# Altium schematic sheet CDS_JETSON_ADAPTER_SCH_v1.0.2.SchDoc
size A3; Author: HaBV3; CompanyName: FPT CORPORATION; Address1: FPT Building,17-Duy Tan,; Address2: Cau Giay, Ha Noi, Viet Nam; Revision: v1.0; SheetNumber: 1; SheetTotal: 3; Project: FPT; DocumentName: Schematic.SchDoc
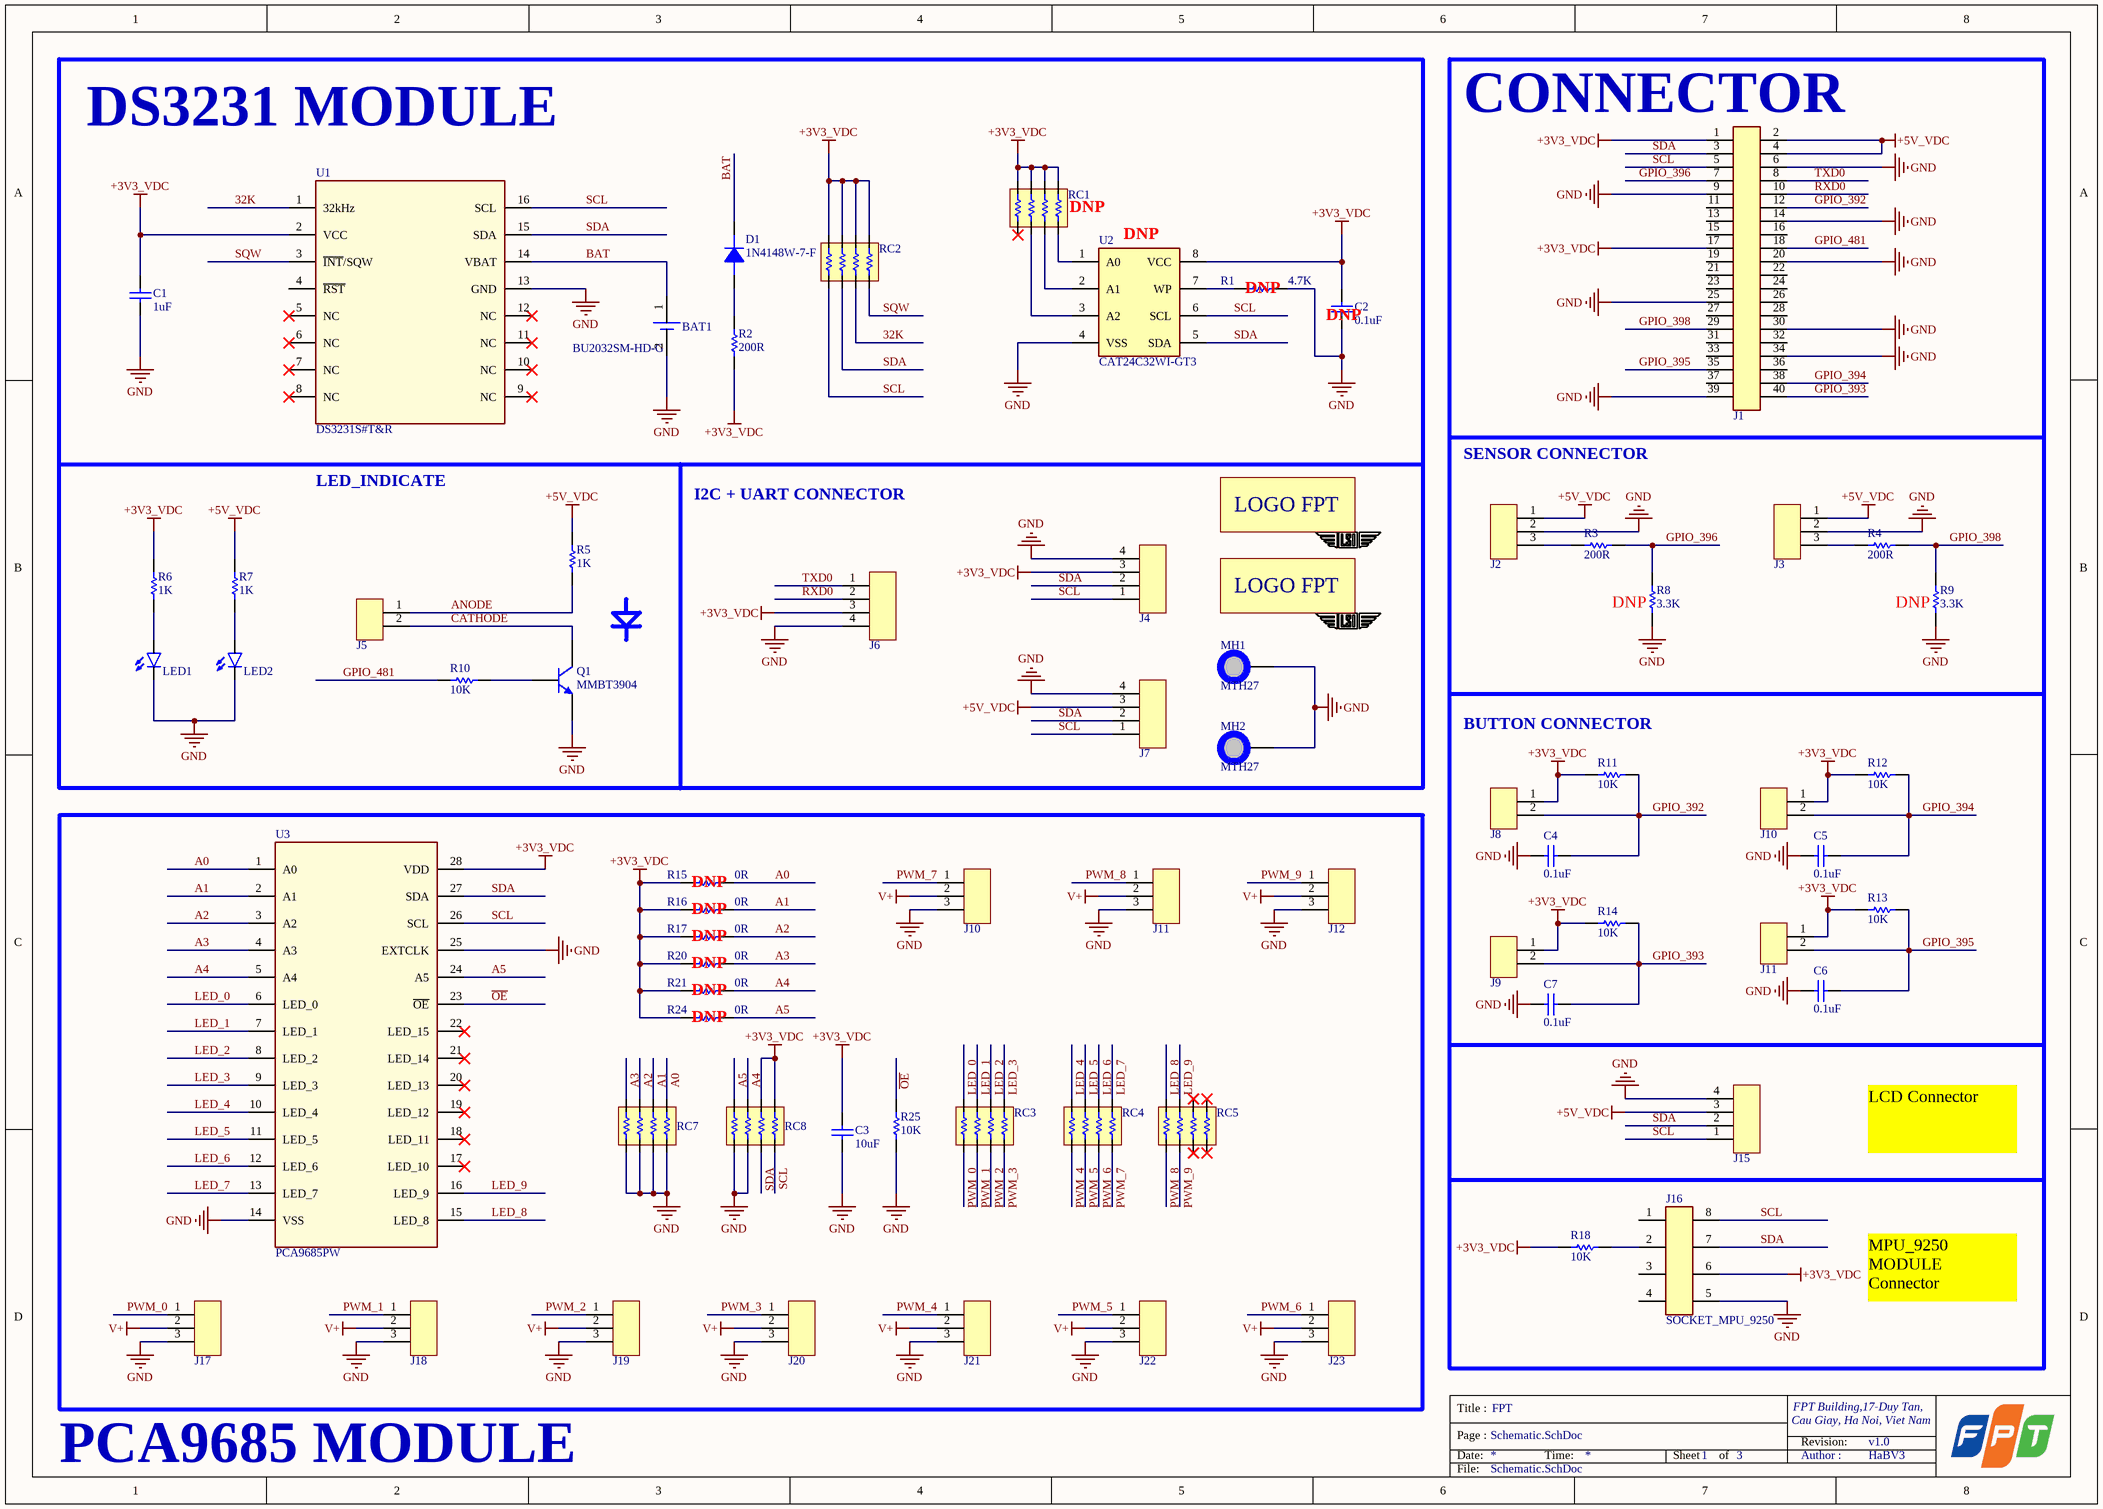
[diagram p0: CDS_JETSON_ADAPTER_SCH_v1.0.2.SchDoc]

## Parts
(Parts that share a designator on the sheet are numbered #1, #2 ... from top to bottom, then left to right.)
BAT1  BU2032SM-HD-G  [BU2032SM-HD-G]
C1  value 1uF  [C0603]  (hidden comment: GRM188R61A106ME69D)
C2  value 0.1uF  [C0603]  (hidden comment: GRM188R70J104KA01D)
C3  value 10uF  [C0603]  (hidden comment: GRM188R61C106KAALD)
C4  value 0.1uF  [C0603]  (hidden comment: GCM188R71H104KA57J)
C5  value 0.1uF  [C0603]  (hidden comment: GCM188R71H104KA57J)
C6  value 0.1uF  [C0603]  (hidden comment: GCM188R71H104KA57J)
C7  value 0.1uF  [C0603]  (hidden comment: GCM188R71H104KA57J)
D1  1N4148W-7-F  [DO-SOD-123]
J1  HDR_2x20  [HEADER_SOCKET_2.54MM_2x20]  (value not drawn)
J2  HDR_1x3  [B3B-XH-A(LF)(SN)]  (value not drawn)
J3  HDR_1x3  [B3B-XH-A(LF)(SN)]  (value not drawn)
J4  HDR_1x4  [B4B-XH-A(LF)(SN)]  (value not drawn)
J5  HDR_1x2  [B2B-XH-A(LF)(SN)]  (value not drawn)
J6  HDR_1x4  [B4B-XH-A(LF)(SN)]  (value not drawn)
J7  HDR_1x4  [B4B-XH-A(LF)(SN)]  (value not drawn)
J8  HDR_1x2  [B2B-XH-A(LF)(SN)]  (value not drawn)
J9  HDR_1x2  [B2B-XH-A(LF)(SN)]  (value not drawn)
J10#1  HDR_1x2  [B2B-XH-A(LF)(SN)]  (value not drawn)
J10#2  HDR_1x3  [PINHEAD_2.54mm_1x3]  (value not drawn)
J11#1  HDR_1x3  [PINHEAD_2.54mm_1x3]  (value not drawn)
J11#2  HDR_1x2  [B2B-XH-A(LF)(SN)]  (value not drawn)
J12  HDR_1x3  [PINHEAD_2.54mm_1x3]  (value not drawn)
J15  HDR_1x4  [B4B-XH-A(LF)(SN)]  (value not drawn)
J16  SOCKET_MPU_9250  [SOCKET_MPU_9250]
J17  HDR_1x3  [PINHEAD_2.54mm_1x3]  (value not drawn)
J18  HDR_1x3  [PINHEAD_2.54mm_1x3]  (value not drawn)
J19  HDR_1x3  [PINHEAD_2.54mm_1x3]  (value not drawn)
J20  HDR_1x3  [PINHEAD_2.54mm_1x3]  (value not drawn)
J21  HDR_1x3  [PINHEAD_2.54mm_1x3]  (value not drawn)
J22  HDR_1x3  [PINHEAD_2.54mm_1x3]  (value not drawn)
J23  HDR_1x3  [PINHEAD_2.54mm_1x3]  (value not drawn)
LED1  LTST-C191KRKT  [LED-SMD-0603-RED]  (value not drawn)
LED2  LTST-C191KRKT  [LED-SMD-0603-RED]  (value not drawn)
LOGO1  LOGOFPT  [LOGO_FPT]  (value not drawn)
LOGO2  LOGOFPT  [LOGO_FPT]  (value not drawn)
MH1  MTH27  [MH_5.2MMD_2.7MMD]
MH2  MTH27  [MH_5.2MMD_2.7MMD]
Q1  MMBT3904  [MMBT3904]
R1  value 4.7K  [R0603]  (hidden comment: RC0603JR-074K7L)
R2  value 200R  [R0603]  (hidden comment: RC0603JR-07200RL)
R3  value 200R  [R0603]  (hidden comment: RC0603JR-07200RL)
R4  value 200R  [R0603]  (hidden comment: RC0603JR-07200RL)
R5  value 1K  [R0603]  (hidden comment: RC0603FR-071KL)
R6  value 1K  [R0603]  (hidden comment: RC0603FR-071KL)
R7  value 1K  [R0603]  (hidden comment: RC0603FR-071KL)
R8  value 3.3K  [R0603]  (hidden comment: RC0603FR-073K3L)
R9  value 3.3K  [R0603]  (hidden comment: RC0603FR-073K3L)
R10  value 10K  [R0603]  (hidden comment: RC0603JR-0710KL)
R11  value 10K  [R0603]  (hidden comment: RC0603JR-0710KL)
R12  value 10K  [R0603]  (hidden comment: RC0603JR-0710KL)
R13  value 10K  [R0603]  (hidden comment: RC0603JR-0710KL)
R14  value 10K  [R0603]  (hidden comment: RC0603JR-0710KL)
R15  value 0R  [R0603]  (hidden comment: RC0603JR-070RL)
R16  value 0R  [R0603]  (hidden comment: RC0603JR-070RL)
R17  value 0R  [R0603]  (hidden comment: RC0603JR-070RL)
R18  value 10K  [R0603]  (hidden comment: RC0603JR-0710KL)
R20  value 0R  [R0603]  (hidden comment: RC0603JR-070RL)
R21  value 0R  [R0603]  (hidden comment: RC0603JR-070RL)
R24  value 0R  [R0603]  (hidden comment: RC0603JR-070RL)
R25  value 10K  [R0603]  (hidden comment: RC0603JR-0710KL)
RC1  YC164-JR-074K7L  [RC_1206]  (value not drawn)
RC2  YC164-JR-074K7L  [RC_1206]  (value not drawn)
RC3  YC164-JR-07220RL  [RC_1206]  (value not drawn)
RC4  YC164-JR-07220RL  [RC_1206]  (value not drawn)
RC5  YC164-JR-07220RL  [RC_1206]  (value not drawn)
RC7  YC164-JR-0710KL  [RC_1206]  (value not drawn)
RC8  YC164-JR-0710KL  [RC_1206]  (value not drawn)
U1  DS3231S#T&R  [SOIC127P1030X265-16N]
U2  CAT24C32WI-GT3  [SOIC127P600X175-8N]
U3  PCA9685PW  [TSOP65P640X110-28N]

## Blocks framed on the sheet
DS3231 MODULE: BAT1 C1 C2 D1 J4-J7 LED1 LED2 LOGO1 LOGO2 MH1 MH2 Q1 R1 R2 R5-R7 R10 RC1 RC2 U1 U2
CONNECTOR: C4-C7 J1-J3 J8 J9 J10#1 J11#2 J15 J16 R3 R4 R8 R9 R11-R14 R18

## Nets
+3V3_VDC: C1.1 C2.2 C3.1 J1.1 J1.17 J4.3 J6.3 J8.1 J9.1 J10#1.1 J11#2.1 J16.6 R2.1 R6.1 R11.2 R12.2 R13.2 R14.2 R15.1 R16.1 R17.1 R18.1 R20.1 R21.1 R24.1 RC1.5 RC1.6 RC1.7 RC1.8 RC2.5 RC2.6 RC2.7 RC2.8 RC8.5 RC8.6 U1.2(VCC) U2.8(VCC) U3.28(VDD)
+5V_VDC: J1.2 J1.4 J2.1 J3.1 J7.3 J15.3 R5.1 R7.1
GND: BAT1.2(-) C1.2 C2.1 C3.2 C4.1 C5.1 C6.1 C7.1 J1.6 J1.9 J1.14 J1.20 J1.25 J1.30 J1.34 J1.39 J2.2 J3.2 J4.4 J6.4 J7.4 J10#2.3 J11#1.3 J12.3 J15.4 J16.5 J17.3 J18.3 J19.3 J20.3 J21.3 J22.3 J23.3 LED1.C LED2.C MH1.1 MH2.1 Q1.2(E) R1.2 R8.2 R9.2 R25.2 RC7.1 RC7.2 RC7.3 RC7.4 RC8.1 RC8.2 U1.13(GND) U2.4(VSS) U3.14(VSS) U3.25(EXTCLK)
V+: J10#2.2 J11#1.2 J12.2 J17.2 J18.2 J19.2 J20.2 J21.2 J22.2 J23.2
32K: RC2.3 U1.1(32kHz)
~{OE}: R25.1 U3.23(~{OE})
A0: R15.2 RC7.5 U3.1(A0)
A1: R16.2 RC7.6 U3.2(A1)
A2: R17.2 RC7.7 U3.3(A2)
A3: R20.2 RC7.8 U3.4(A3)
A4: R21.2 RC8.7 U3.5(A4)
A5: R24.2 RC8.8 U3.24(A5)
ANODE: J5.1 R5.2
BAT: BAT1.1(+) D1.1(CATHODE) U1.14(VBAT)
CATHODE: J5.2 Q1.3(C)
GPIO_392: C4.2 J1.12 J8.2 R11.1
GPIO_393: C7.2 J1.40 J9.2 R14.1
GPIO_394: C5.2 J1.38 J10#1.2 R12.1
GPIO_395: C6.2 J1.35 J11#2.2 R13.1
GPIO_396: J1.7 R3.1 R8.1
GPIO_398: J1.29 R4.1 R9.1
GPIO_481: J1.18 R10.1
LED_0: RC3.8 U3.6(LED_0)
LED_1: RC3.7 U3.7(LED_1)
LED_2: RC3.6 U3.8(LED_2)
LED_3: RC3.5 U3.9(LED_3)
LED_4: RC4.8 U3.10(LED_4)
LED_5: RC4.7 U3.11(LED_5)
LED_6: RC4.6 U3.12(LED_6)
LED_7: RC4.5 U3.13(LED_7)
LED_8: RC5.8 U3.15(LED_8)
LED_9: RC5.7 U3.16(LED_9)
PWM_0: J17.1 RC3.1
PWM_1: J18.1 RC3.2
PWM_2: J19.1 RC3.3
PWM_3: J20.1 RC3.4
PWM_4: J21.1 RC4.1
PWM_5: J22.1 RC4.2
PWM_6: J23.1 RC4.3
PWM_7: J10#2.1 RC4.4
PWM_8: J11#1.1 RC5.1
PWM_9: J12.1 RC5.2
RXD0: J1.10 J6.2
SCL: J1.5 J4.1 J7.1 J15.1 J16.8 RC2.1 RC8.4 U1.16(SCL) U2.6(SCL) U3.26(SCL)
SDA: J1.3 J4.2 J7.2 J15.2 J16.7 RC2.2 RC8.3 U1.15(SDA) U2.5(SDA) U3.27(SDA)
SQW: RC2.4 U1.3(~{INT}/SQW)
TXD0: J1.8 J6.1
NetD1_2: D1.2(ANODE) R2.2
NetJ2_3: J2.3 R3.2
NetJ3_3: J3.3 R4.2
NetJ16_2: J16.2 R18.2
NetLED1_A: LED1.A R6.2
NetLED2_A: LED2.A R7.2
NetQ1_1: Q1.1(B) R10.2
NetR1_1: R1.1 U2.7(WP)
NetRC1_2: RC1.2 U2.3(A2)
NetRC1_3: RC1.3 U2.2(A1)
NetRC1_4: RC1.4 U2.1(A0)

Not connected (* = marked no-connect by the designer): J1 11 13 15 16 19 21 22 23 24 26 27 28 31 32 33 36 37; J16 1 3 4; RC1 1*; RC5 3* 4* 5* 6*; U1 4(~{RST}) 5(NC)* 6(NC)* 7(NC)* 8(NC)* 9(NC)* 10(NC)* 11(NC)* 12(NC)*; U3 17(LED_10)* 18(LED_11)* 19(LED_12)* 20(LED_13)* 21(LED_14)* 22(LED_15)*

## Notes on the sheet
- (near RC1) DNP
- (near U2) DNP
- (near R1) DNP
- (near C2) DNP
- LED_INDICATE
- I2C + UART CONNECTOR
- SENSOR CONNECTOR
- (near R8) DNP
- (near R9) DNP
- (near R11) BUTTON CONNECTOR
- (near R15) DNP
- (near R16) DNP
- (near R17) DNP
- (near R20) DNP
- (near R21) DNP
- (near R24) DNP
- LCD Connector
- MPU_9250 MODULE Connector
- PCA9685 MODULE
- Title :
- Page :
- Date:
- Time:
- Sheet
- of
- Author :
- Revision:
- File:
- (in symbol LOGO-FPT) LOGO FPT

## Library data of the parts
BAT1 = BU2032SM-HD-G: =Description; Part Name: Battery Holder; Manufacturer Part Description: HOLDER COIN CELL 2032 SMD; Manufacturer Name: MPD; Battery Type: Coin Cell, Holder; Style: Holder; Battery Cell Size: Coin, 20mm; Battery Series: 2032; Part Number: BU2032SM-HD-G; Series: -; Mounting Type: PCB, Surface Mount; Termination Style: SMD (SMT) Tab; Height: 5.28mm; Operating Temperature: -40°C ~ 280°C; Manufacturer Part Number: BU2032SM-HD-G; Supplier Name: Digi-Key
C1 = GRM188R61A106ME69D: CAP CER 10UF 10V X5R 0603; Part Name: CAP-CERAMIC-0603; Manufacturer Name: Murata; Tolerance: ±20%; Part Number: GRM188R61A106ME69D; Manufacturer Part Number: GRM188R61A106ME69D; Supplier Name: Digi-Key; Rated Voltage: 10V; Package: 0603 (1608 Metric); Operating Temperature: -55°C ~ 85°C
C2 = GRM188R70J104KA01D: CAP CER 0.1UF 6.3V X7R 0603; Part Name: CAP-CERAMIC-0603; Manufacturer Name: Murata; Tolerance: 10%; Part Number: GRM188R70J104KA01D; Manufacturer Part Number: GRM188R70J104KA01D; Supplier Name: Digi-Key; Rated Voltage: 6.3V; Package: 0603 (1608 Metric); Operating Temperature: -55°C ~ 125°C
C3 = GRM188R61C106KAALD: CAP CER 10UF 16V X5R 0603; Part Name: CAP-CERAMIC-0603; Manufacturer Name: Murata; Tolerance: ±10%; Part Number: GRM188R61C106KAALD; Manufacturer Part Number: GRM188R61C106KAALD; Supplier Name: Digi-Key; Rated Voltage: 16V; Package: 0603 (1608 Metric); Operating Temperature: -55°C ~ 125°C
C4-C7 = GCM188R71H104KA57J: CAP CER 0.1UF 50V X7R 0603; Part Name: CAP-CERAMIC-0603; Manufacturer Name: Murata; Tolerance: ±10%; Part Number: GCM188R71H104KA57J; Supplier Name: Digi-Key; Rated Voltage: 50V; Package: 0603; Operating Temperature: -55°C ~ 125°C
D1 = 1N4148W-7-F: DIODE GEN PURP 100V 300MA SOD123; Manufacturer Name: Diodes Incorporated; Type: Standard; Current Average Rectified (Io): 300mA (DC); Voltage Forward (Vf) (Max): 1.25V @ 150mA; Reverse Recovery Time (trr): 4ns; Current Reverse Leakage @ Vr: 1µA @ 75V; Capacitance: 2pF @ 0V, 1MHz; Part Number: 1N4148W-7-F; Part Name: 1N4148W-7-F; Manufacturer Part Number: 1N4148W-7-F; Supplier Name: Digi-Key; Voltage DC Reverse (Vr) (Max): 100V; Speed: =< 200mA (Io); Operating Temperature: -55°C ~ 150°C (TJ)
J1 = SSW-120-03-G-D: CONN RCPT .100" 40POS DUAL GOLD; Manufacturer Name: Samtec Inc.; Connector Type: Receptacle; Number of Positions/Contacts: 40; Part Number: SSW-120-03-G-D; Part Name: HEADER_SOCKET_2.54MM_2x20; Series: SSW; Contact Type: Forked; Supplier Part Number: Digi-Key
J2 J3 = B3B-XH-A(LF)(SN): Connector Type: Header; Part Number: B3B-XH-A(LF)(SN); Part Name: B3B-XH-A(LF)(SN); Series: XH; Contact Type: Male Pin
J4 J6 J7 J15 = B4B-XH-A(LF)(SN): CONN HEADER XH TOP 4POS 2.5MM; Manufacturer Name: JST Sales America Inc.; Number of Positions/Contacts: 4; Part Number: B4B-XH-A(LF)(SN); Series: XH; Contact Type: Male Pin; Connector Type: Header; Supplier Part Number: Digi-Key
J5 J8 J9 J10#1 J11#2 = B2B-XH-A(LF)(SN): CONN HEADER XH TOP 2POS 2.5MM; Manufacturer Name: JST Sales America Inc; Connector Type: Header, Shrouded; Number of Positions/Contacts: 2; Part Number: B2B-XH-A(LF)(SN); Series: XH; Contact Type: Male Pin; Supplier Part Number: Digi-Key
J10#2 J11#1 J12 J17-J23 = 61300311121: CONN HEADER 3 POS 2.54; Manufacturer Name: Wurth Electronics Inc.; Number of Positions/Contacts: 3; Part Number: 61300311121; Part Name: HDR_1x3; Series: WR-PHD; Contact Type: Male Pin; Connector Type: Header; Supplier Part Number: Digi-Key
J16 = MPU_9250: Part Number: MPU_9250; Part Name: MPU_9250
LED1 LED2 = LTST-C191KRKT: LED RED CLEAR 0603 SMD; Part Name: LED-SMD-1608-55; Manufacturer Name: Lite-One Inc.; Lens Color: Colorless; Millicandela Rating: 54mcd; Lens Style/Size: Rectangle with Flat Top, 1.10mm x 0.80mm; Voltage - Forward (Vf) (Typ): 2V; Current - Test: 20mA; Viewing Angle: 130°; Wavelength - Dominant: 631nm; Wavelength - Peak: 639nm; Part Number: LTST-C191KRKT; Package: 0603 (1608 Metric); Height Max: 0.55mm; Led Color: Red; Lens Transparency: Clear; Mounting Type: Surface Mount; Manufacturer Part Number: LTST-C191KRKT; Supplier Name: Digi-Key
LOGO1 LOGO2 = LOGO-FPT: =Description; Part Name: LOGO; Manufacturer Part Description: FPT Logo; Part Number: LOGO-FPT
MH1 MH2 = MTH27: =Description; Manufacturer Part Description: Mouting Hole 2.7mm; Part Number: MTH27; Part Name: MTH27
Q1 = MMBT3904: TRANS NPN 40V 0.2A SOT23; Part Name: TRANS-NPN; Manufacturer Name: Fairchild/ON Semiconductor; Frequency - Transition: 350mW; Published: 17-Sep-2003; LatestRevisionDate: 12-Dec-2006; LatestRevisionNote: IPC-7351 Footprint Added.; DatasheetVersion: 13-May-2002; PackageVersion: May-1999; PackageReference: SOT23; Publisher: Altium Limited; PackageDescription: 3-Pin SOT-23 Package 0.95 mm Pitch, 2.3 mm Lead Span; ComponentLink1Description: Manufacturer Link; ComponentLink1URL: http://www.semiconductors.philips.com/; ComponentLink2Description: Datasheet; ComponentLink2URL: http://www.semiconductors.philips.com/acrobat/datasheets/MMBT3904_4.pdf; Supplier 1: Digi-Key; Supplier Part Number 1: MMBT3904FSDKR-ND; Part Number: MMBT3904; Type: NPN; Voltage - Collector Emitter Breakdown (Max): 40V; Operating Temperature: -55°C ~ 150°C (TJ); Package: SOT-23-3; Supplier Name: Digi-Key
R1 = RC0603JR-074K7L: RES SMD 4.7K OHM 5% 1/10W 0603; Manufacturer Name: Yageo; Rated Power: 0.1W; Part Number: RC0603JR-074K7L; Part Name: RES-0603; Manufacturer Part Number: RC0603JR-074K7L; Supplier Name: Digi-Key; Tolerance: ±5%; Package: 0603; Operating Temperature: -55°C ~ 155°C
R2-R4 = RC0603JR-07200RL: RES SMD 200 OHM 5% 1/10W 0603; Manufacturer Name: Yageo; Rated Power: 0.1W; Part Number: RC0603JR-07200RL; Part Name: RES-0603; Manufacturer Part Number: RC0603JR-07200RL; Supplier Name: Digi-Key; Tolerance: ±5%; Package: 0603; Operating Temperature: -55°C ~ 155°C
R5-R7 = RC0603FR-071KL: RES SMD 1K OHM 1% 1/10W 0603; Manufacturer Name: Yageo; Rated Power: 0.15W; Part Number: RC0603FR-071KL; Part Name: RES-0603; Manufacturer Part Number: RC0603FR-071KL; Supplier Name: Digi-Key; Tolerance: 1%; Package: 0603; Operating Temperature: -55°C ~ 155°C
R8 R9 = RC0603FR-073K3L: RES SMD 3.3K OHM 1% 1/10W 0603; Manufacturer Name: Yageo; Rated Power: 0.1W; Part Number: RC0603FR-073K3L; Part Name: RES-0603; Manufacturer Part Number: RC0603FR-073K3L; Supplier Name: Digi-Key; Tolerance: ±1%; Package: 0603; Operating Temperature: -55°C ~ 155°C
R10-R14 R18 R25 = RC0603JR-0710KL: RES SMD 10K OHM 5% 1/10W 0603; Manufacturer Name: Yageo; Rated Power: 0.1W; Part Number: RC0603JR-0710KL; Part Name: RES-0603; Manufacturer Part Number: RC0603JR-0710KL; Supplier Name: Digi-Key; Tolerance: ±5%; Package: 0603; Operating Temperature: -55°C ~ 155°C
R15-R17 R20 R21 R24 = RC0603JR-070RL: RES SMD 0.0OHM JUMPER 1/10W 0603; Manufacturer Name: Yageo; Tolerance: 1%; Rated Power: 0.15W; Part Number: RC0603JR-070RL; Part Name: RES-0603; Manufacturer Part Number: RC0603JR-070RL; Supplier Name: Digi-Key; Package: 0603; Operating Temperature: -55°C ~ 155°C
RC1 RC2 = YC164-JR-074K7L: RES ARRAY 4 RES 4.7K OHM 1206; Manufacturer Name: Yageo; Tolerance: ±5%; Rated Power: 0.1W; Part Number: YC164-JR-074K7L; Part Name: RC; Manufacturer Part Number: YC164-JR-074K7L; Supplier Name: Digi-Key; Value: 4.7K; Package: 1206; Operating Temperature: -55°C ~ 155°C
RC3-RC5 = YC164-JR-07220RL: RES ARRAY 4 RES 220 OHM 1206; Manufacturer Name: Yageo; Value: 220R; Tolerance: ±5%; Rated Power: 0.1W; Part Number: YC164-JR-07220RL; Part Name: RC; Manufacturer Part Number: YC164-JR-07220RL; Supplier Name: Digi-Key; Package: 1206; Operating Temperature: -55°C ~ 155°C
RC7 RC8 = YC164-JR-0710KL: RES ARRAY 4 RES 10K OHM 1206; Manufacturer Name: Yageo; Tolerance: ±5%; Rated Power: 0.1W; Part Number: YC164-JR-0710KL; Part Name: RC; Manufacturer Part Number: YC164-JR-0710KL; Supplier Name: Digi-Key; Value: 10K; Package: 1206; Operating Temperature: -55°C ~ 155°C
U1 = DS3231S#T&R: IC RTC CLK/CALENDAR I2C 16-SOIC; Manufacturer Name: Maxim; Time Format: HH:MM:SS (12/24 hr); Date Format: YY-MM-DD-dd; Interface: I²C, 2-Wire Serial; Voltage - Supply: 2.3 V ~ 5.5 V; Current - Timekeeping (Max): 110µA ~ 170µA @ 3.63V ~ 5.5V; Part Number: DS3231S#T&R; Part Name: DS3231S#T&R; Serial: -; Type: Clock/Calendar; Voltage - Supply, Battery: 2.3 V ~ 5.5 V; Operating Temperature: 0°C ~ 70°C; Manufacturer Part Number: DS3231S#T&R; Supplier Name: Digi-key
U2 = CAT24C32WI-GT3: IC EEPROM 32K I2C 1MHZ 8SOIC; Manufacturer Name: ON Semiconductor; Memory Type: Non-Volatile; Memory Size: 32Kb(4Kx8); Voltage Supply: 1.7 V ~ 5.5 V; Part Number: CAT24C32WI-GT3; Part Name: CAT24C32WI-GT3; Series: -; Interface: I2C; Speed: 1mhZ; Operating Temperature: -40°C ~ 85°C (TA); Manufacturer Part Number: CAT24C32WI-GT3; Supplier Name: Digi-Key; Package: 8-SOIC
U3 = PCA9685PW: IC LED DRIVER RGBA 28-TSSOP; Manufacturer Name: NXP USA Inc.; Manufacturer Part Number: PCA9685PW,118; Internal Switch(s): Yes; Number of Outputs: 16; Voltage - Supply (Min): 2.3V; Voltage - Supply (Max): 5.5V; Current - Output / Channel: 25mA; Dimming: PWM; Part Number: PCA9685PW; Part Name: PCA9685PW; Serial: -; Type: Linear; Topology: -; Voltage - Output: 5.5V; Frequency: -; Applications: Backlight; Operating Temperature: -40°C ~ 85°C (TA); Supplier Name: Digi-key